# Altium schematic sheet ThietbiTN.SchDoc
size A4
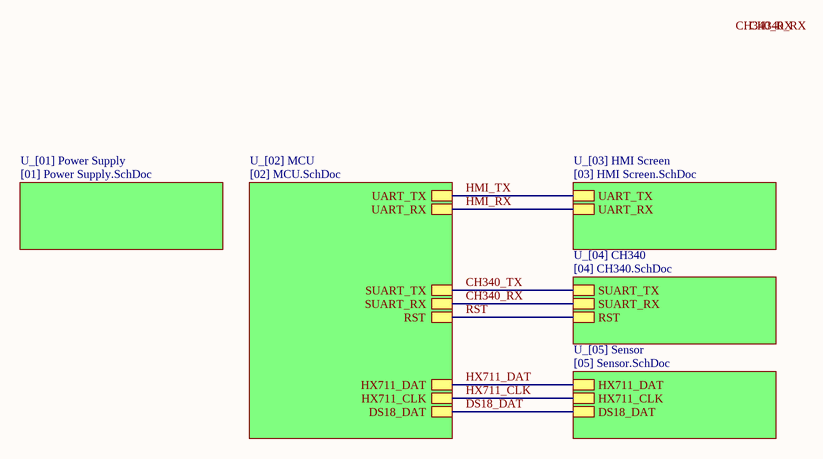
[diagram p0: ThietbiTN.SchDoc]

## Sub-sheets
U_[01] Power Supply = [01] Power Supply.SchDoc: no entries
U_[02] MCU = [02] MCU.SchDoc: DS18_DAT, HX711_CLK, HX711_DAT, UART_TX, UART_RX, SUART_RX, SUART_TX, RST
U_[03] HMI Screen = [03] HMI Screen.SchDoc: UART_RX, UART_TX
U_[04] CH340 = [04] CH340.SchDoc: SUART_RX, SUART_TX, RST
U_[05] Sensor = [05] Sensor.SchDoc: HX711_DAT, HX711_CLK, DS18_DAT

## Nets
CH340_RX: sheet U_[02] MCU/SUART_RX, sheet U_[04] CH340/SUART_RX
CH340_TX: sheet U_[02] MCU/SUART_TX, sheet U_[04] CH340/SUART_TX
DS18_DAT: sheet U_[02] MCU/DS18_DAT, sheet U_[05] Sensor/DS18_DAT
HMI_RX: sheet U_[02] MCU/UART_RX, sheet U_[03] HMI Screen/UART_RX
HMI_TX: sheet U_[02] MCU/UART_TX, sheet U_[03] HMI Screen/UART_TX
HX711_CLK: sheet U_[02] MCU/HX711_CLK, sheet U_[05] Sensor/HX711_CLK
HX711_DAT: sheet U_[02] MCU/HX711_DAT, sheet U_[05] Sensor/HX711_DAT
RST: sheet U_[02] MCU/RST, sheet U_[04] CH340/RST

## Notes on the sheet
- Labels drawn without touching a wire or pin: CH340_RX